# EAGLE design floppyconv (EAGLE 6.5.0)
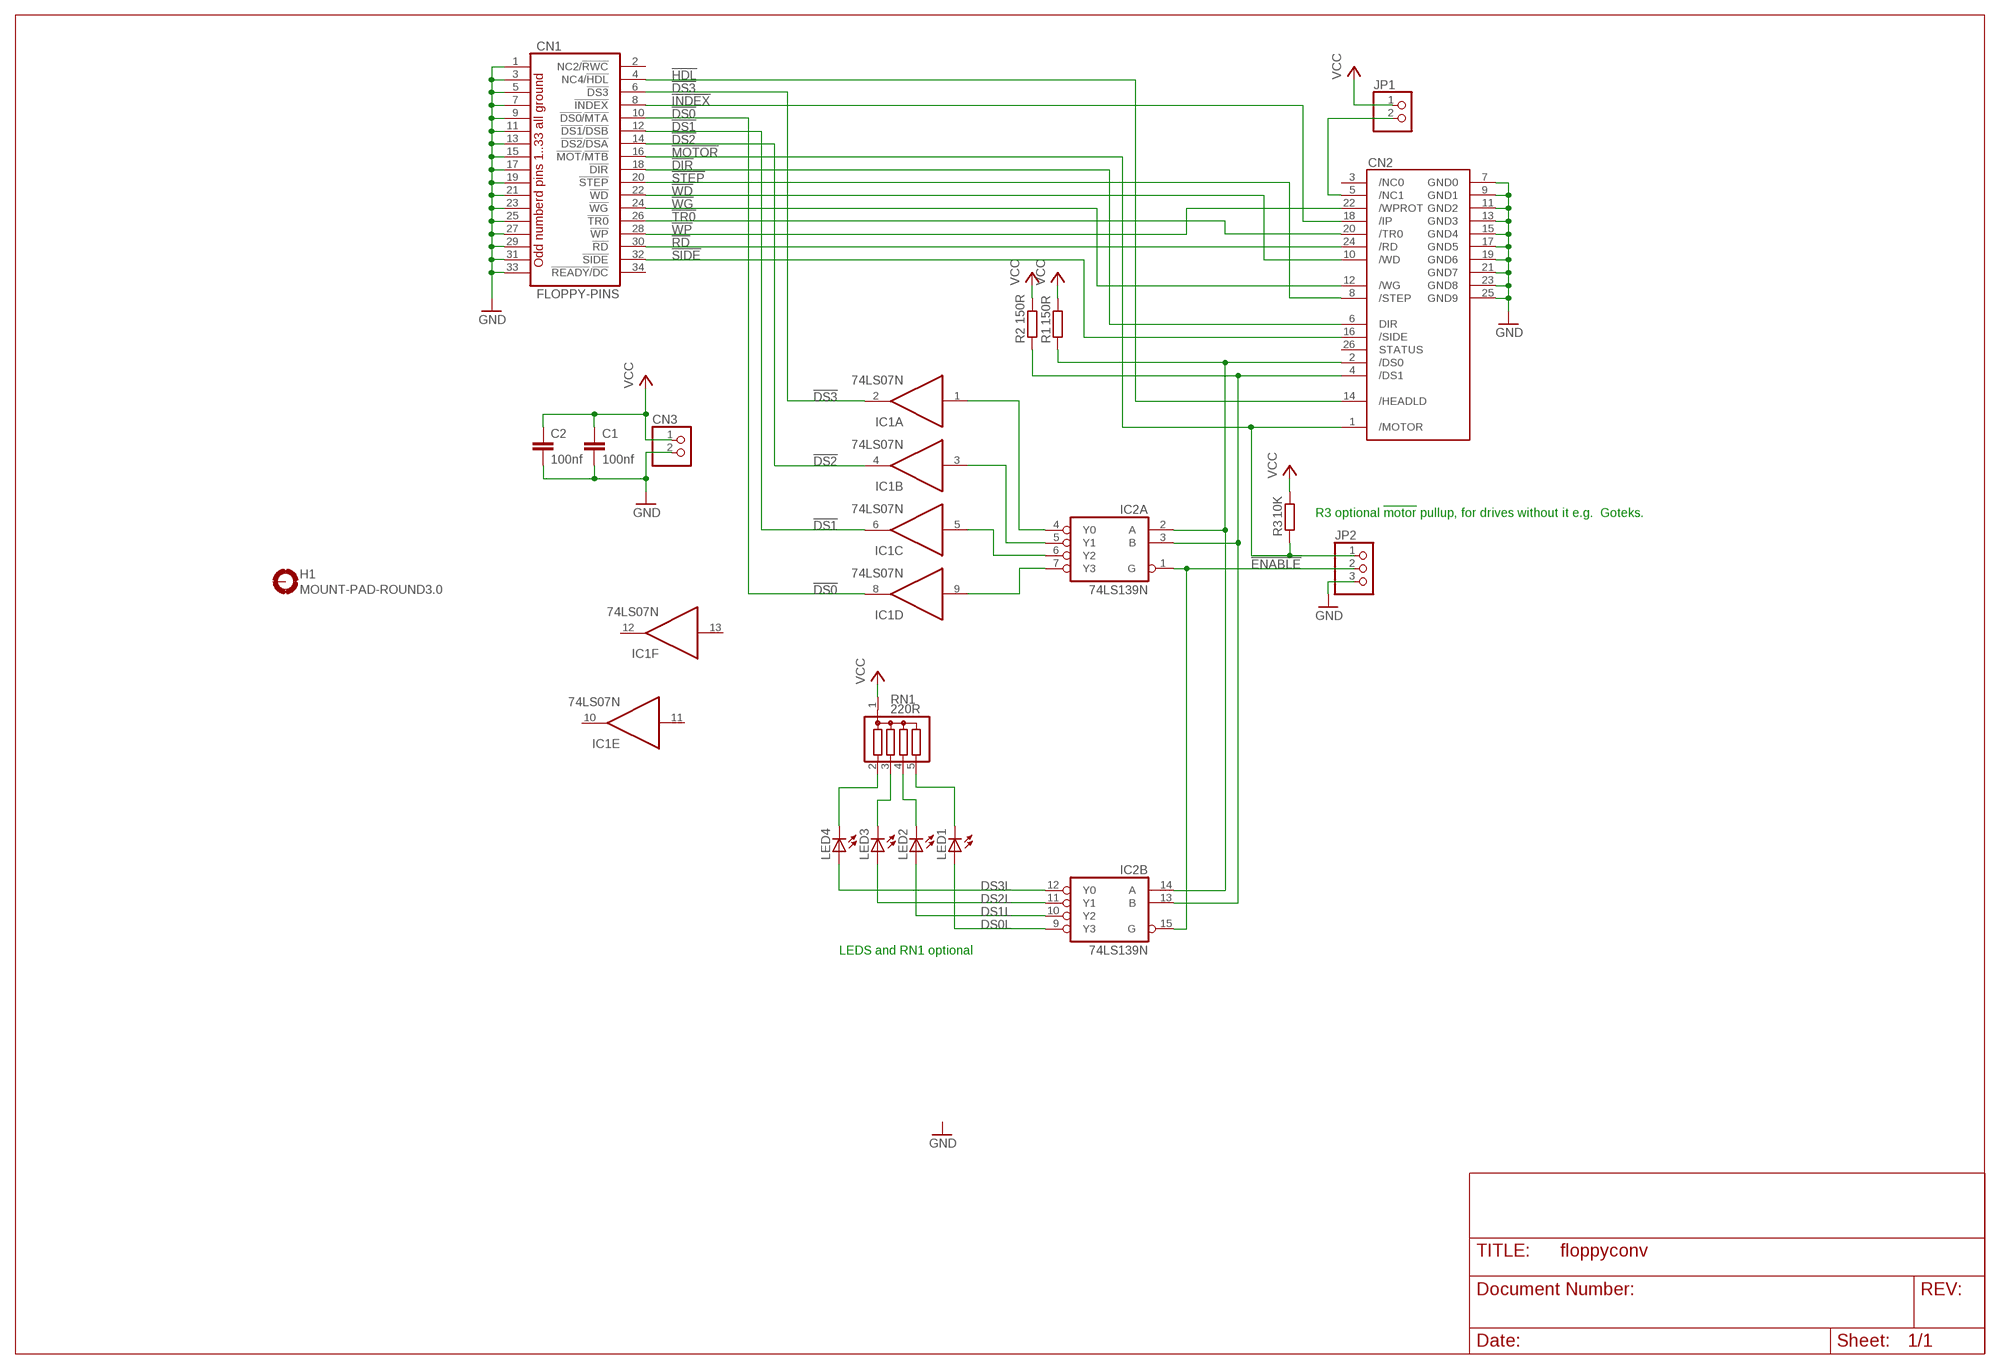
[diagram p0: schematic, sheet 1]

## Parts
C1  100nf  C-EU025-025X050  [C025-025X050]
C2  100nf  C-EU025-025X050  [C025-025X050]
CN1  FLOPPY-PINS  [FLOPPY-PINS]
CN2  DRAGON-BETA-FLOPPY  [2X13]
CN3  PINHD-1X2  [1X02]
H1  MOUNT-PAD-ROUND3.0  [3,0-PAD]
IC1  74LS07N  [DIL14]
IC2  74LS139N  [DIL16]
JP1  PINHD-1X2  [1X02]
JP2  PINHD-1X3  [1X03]
LED1  LED3MM  [LED3MM]
LED2  LED3MM  [LED3MM]
LED3  LED3MM  [LED3MM]
LED4  LED3MM  [LED3MM]
R1  150R  R-EU_0207/10  [0207/10]
R2  150R  R-EU_0207/10  [0207/10]
R3  10K  R-EU_0207/10  [0207/10]
RN1  220R  G04R-R  [SIL5R]

## Nets
!BDS0: CN2.2(/DS0) IC2.2(A:A) IC2.14(B:A) R1.1
!BDS1: CN2.4(/DS1) IC2.3(A:B) IC2.13(B:B) R2.1
!DIR: CN1.18(!DIR) CN2.6(DIR)
!DS0: CN1.10(!DS0!/!MTA) IC1.8(D:O)
!DS1: CN1.12(!DS1!/!DSB) IC1.6(C:O)
!DS2: CN1.14(!DS2!/!DSA) IC1.4(B:O)
!DS3: CN1.6(!DS3) IC1.2(A:O)
!ENABLE: IC2.1(A:G) IC2.15(B:G) JP2.2
!HDL: CN1.4(NC4/!HDL) CN2.14(/HEADLD)
!INDEX: CN1.8(!INDEX) CN2.18(/IP)
!MOTOR: CN1.16(!MOT!/!MTB) CN2.1(/MOTOR) JP2.1 R3.1
!RD: CN1.30(!RD) CN2.24(/RD)
!SIDE: CN1.32(!SIDE) CN2.16(/SIDE)
!STEP: CN1.20(!STEP) CN2.8(/STEP)
!TR0: CN1.26(!TR0) CN2.20(/TR0)
!WD: CN1.22(!WD) CN2.10(/WD)
!WG: CN1.24(!WG) CN2.12(/WG)
!WP: CN1.28(!WP) CN2.22(/WPROT)
DS0L: IC2.9(B:Y3) LED1.A
DS1L: IC2.10(B:Y2) LED2.A
DS2L: IC2.11(B:Y1) LED3.A
DS3L: IC2.12(B:Y0) LED4.A
GND: C1.2 C2.2 CN1.1(GND) CN1.3(GND) CN1.5(GND) CN1.7(GND) CN1.9(GND) CN1.11(GND) CN1.13(GND) CN1.15(GND) CN1.17(GND) CN1.19(GND) CN1.21(GND) CN1.23(GND) CN1.25(GND) CN1.27(GND) CN1.29(GND) CN1.31(GND) CN1.33(GND) CN2.7(GND0) CN2.9(GND1) CN2.11(GND2) CN2.13(GND3) CN2.15(GND4) CN2.17(GND5) CN2.19(GND6) CN2.21(GND7) CN2.23(GND8) CN2.25(GND9) CN3.2 JP2.3
N$1: IC1.1(A:I) IC2.4(A:Y0)
N$2: IC1.3(B:I) IC2.5(A:Y1)
N$3: IC1.5(C:I) IC2.6(A:Y2)
N$4: IC1.9(D:I) IC2.7(A:Y3)
N$9: LED1.K(C) RN1.5
N$10: LED2.K(C) RN1.4
N$11: LED3.K(C) RN1.3
N$12: LED4.K(C) RN1.2
N$13: CN2.5(/NC1) JP1.2
VCC: C1.1 C2.1 CN3.1 JP1.1 R1.2 R2.2 R3.2 RN1.1
Unconnected: CN1.2(NC2/!RWC) CN1.34(!READY!/!DC) CN2.3(/NC0) CN2.26(STATUS) H1.B3,0(MOUNT) IC1.10(E:O) IC1.11(E:I) IC1.12(F:O) IC1.13(F:I)

## Notes on the sheet
- R3 optional !motor! pullup, for drives without it e.g.  Goteks.
- LEDS and RN1 optional

## Power pins joined to a net without a drawn wire
GND: IC1.7(P:GND) IC2.8(P:GND)
VCC: IC1.14(P:VCC) IC2.16(P:VCC)

## Library data of the parts
C1 C2 = rcl:C-EU: CAPACITOR, European symbol
CN1 = Conn-floppy:FLOPPY-PINS: Standard Shugart floppy connector as used on 3.5" drives
CN2 = Conn-floppy:DRAGON-BETA-FLOPPY
CN3 JP1 = pinhead-round:PINHD-1X2: PIN HEADER
H1 = holes:MOUNT-PAD-ROUND: MOUNTING PAD, round
IC1 = 74xx-eu-round:74*07: Hex BUFFER, open collector high-voltage output
IC2 = 74xx-eu-round:74*139: Dual 2-line to 4-line DECODER/DEMULTIPLEXER
JP2 = pinhead-round:PINHD-1X3: PIN HEADER
LED1-LED4 = led:LED: LED OSRAM: - CHIPLED LG R971, LG N971, LY N971, LG Q971, LY Q971, LO R971, LY R971 LH N974, LH R974 LS Q976, LO Q976, LY Q976 LO Q996 - Hyper CHIPLED LW Q18S LB Q993, LB Q99A, LB R99A - SideLED LS A670, LO A670, LY A670, LG A670, LP A670 LB A673, LV A673, LT A673, LW A673 LH A674 LY A675 LS A676, LA A676, LO A676, LY A676, LW A676 LS A679, LY A679, LG A679 - Hyper Micro SIDELED® LS Y876, LA Y876, LO Y876, LY Y876 LT Y87S - SmartLED LW L88C, LW L88S LB L89C, LB L89S, LG L890 LS L89K, LO L89K, LY L89K LS L896, LA L896, LO L896, LY L896 - TOPLED LS T670, LO T670, LY T670, LG T670, LP T670 LSG T670, LSP T670, LSY T670, LOP T670, LYG T670 LG T671, LOG T671, LSG T671 LB T673, LV T673, LT T673, LW T673 LH T674 LS T676, LA T676, LO T676, LY T676, LB T676, LH T676, LSB T676, LW T676 LB T67C, LV T67C, LT T67C, LS T67K, LO T67K, LY T67K, LW E67C LS E67B, LA E67B, LO E67B, LY E67B, LB E67C, LV E67C, LT E67C LW T67C LS T679, LY T679, LG T679 LS T770, LO T770, LY T770, LG T770, LP T770 LB T773, LV T773, LT T773, LW T773 LH T774 LS E675, LA E675, LY E675, LS T675 LS T776, LA T776, LO T776, LY T776, LB T776 LHGB T686 LT T68C, LB T68C - Hyper Mini TOPLED® LB M676 - Mini TOPLED Santana® LG M470 LS M47K, LO M47K, LY M47K Source: http://www.osram.convergy.de LUXEON: - LUMILED® LXK2-PW12-R00, LXK2-PW12-S00, LXK2-PW14-U00, LXK2-PW14-V00 LXK2-PM12-R00, LXK2-PM12-S00, LXK2-PM14-U00 LXK2-PE12-Q00, LXK2-PE12-R00, LXK2-PE12-S00, LXK2-PE14-T00, LXK2-PE14-U00 LXK2-PB12-K00, LXK2-PB12-L00, LXK2-PB12-M00, LXK2-PB14-N00, LXK2-PB14-P00, LXK2-PB14-Q00 LXK2-PR12-L00, LXK2-PR12-M00, LXK2-PR14-Q00, LXK2-PR14-R00 LXK2-PD12-Q00, LXK2-PD12-R00, LXK2-PD12-S00 LXK2-PH12-R00, LXK2-PH12-S00 LXK2-PL12-P00, LXK2-PL12-Q00, LXK2-PL12-R00 Source: www.luxeon.com KINGBRIGHT: KA-3528ASYC Source: www.kingbright.com
R1-R3 = rcl:R-EU_: RESISTOR, European symbol
RN1 = Misc:G04R: SIL RESISTOR

## Board
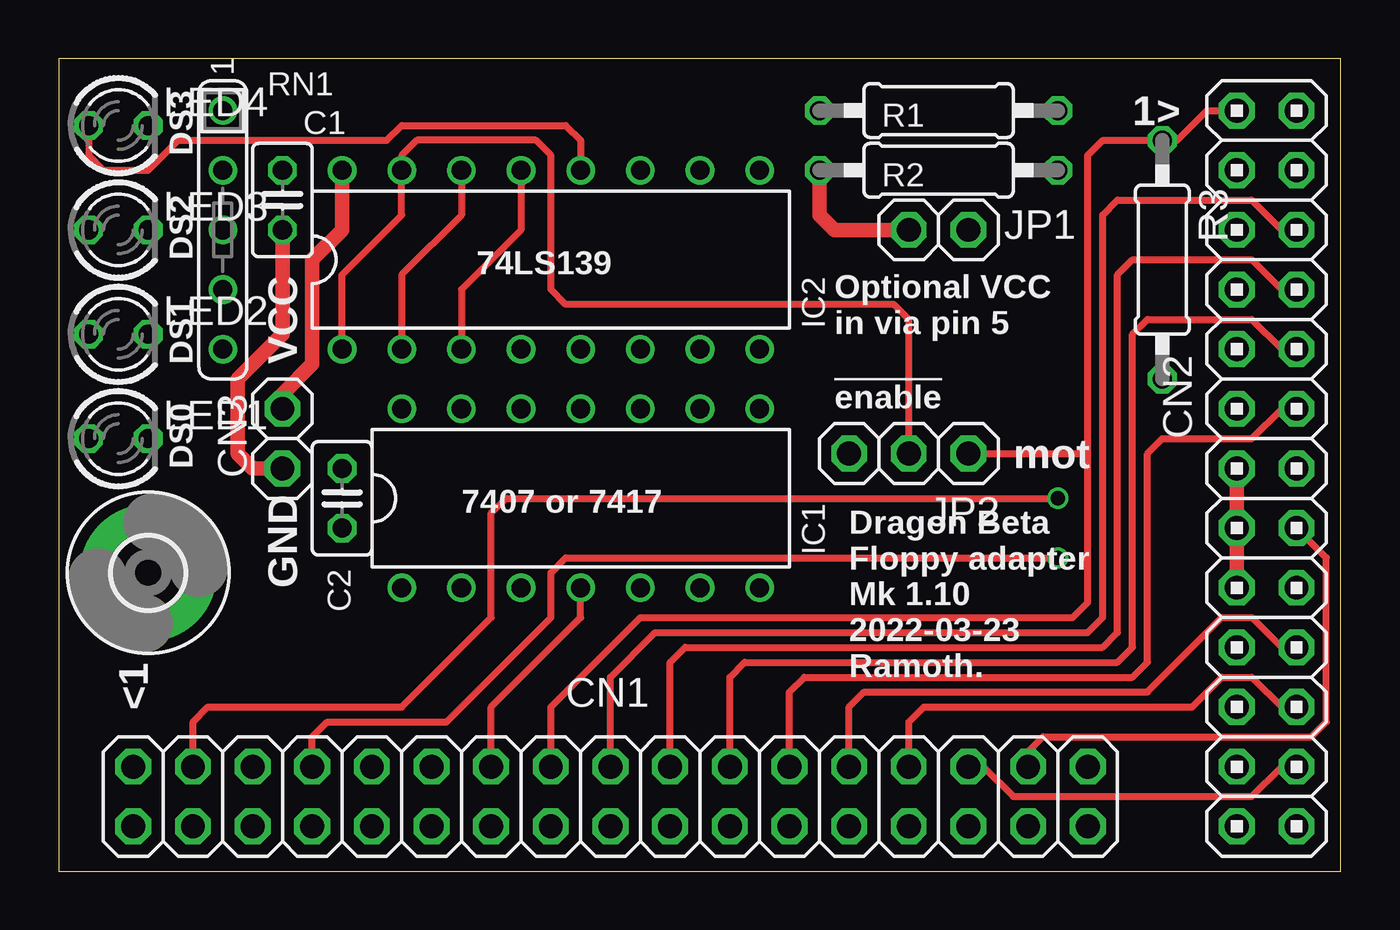
[diagram p1: board, top side]
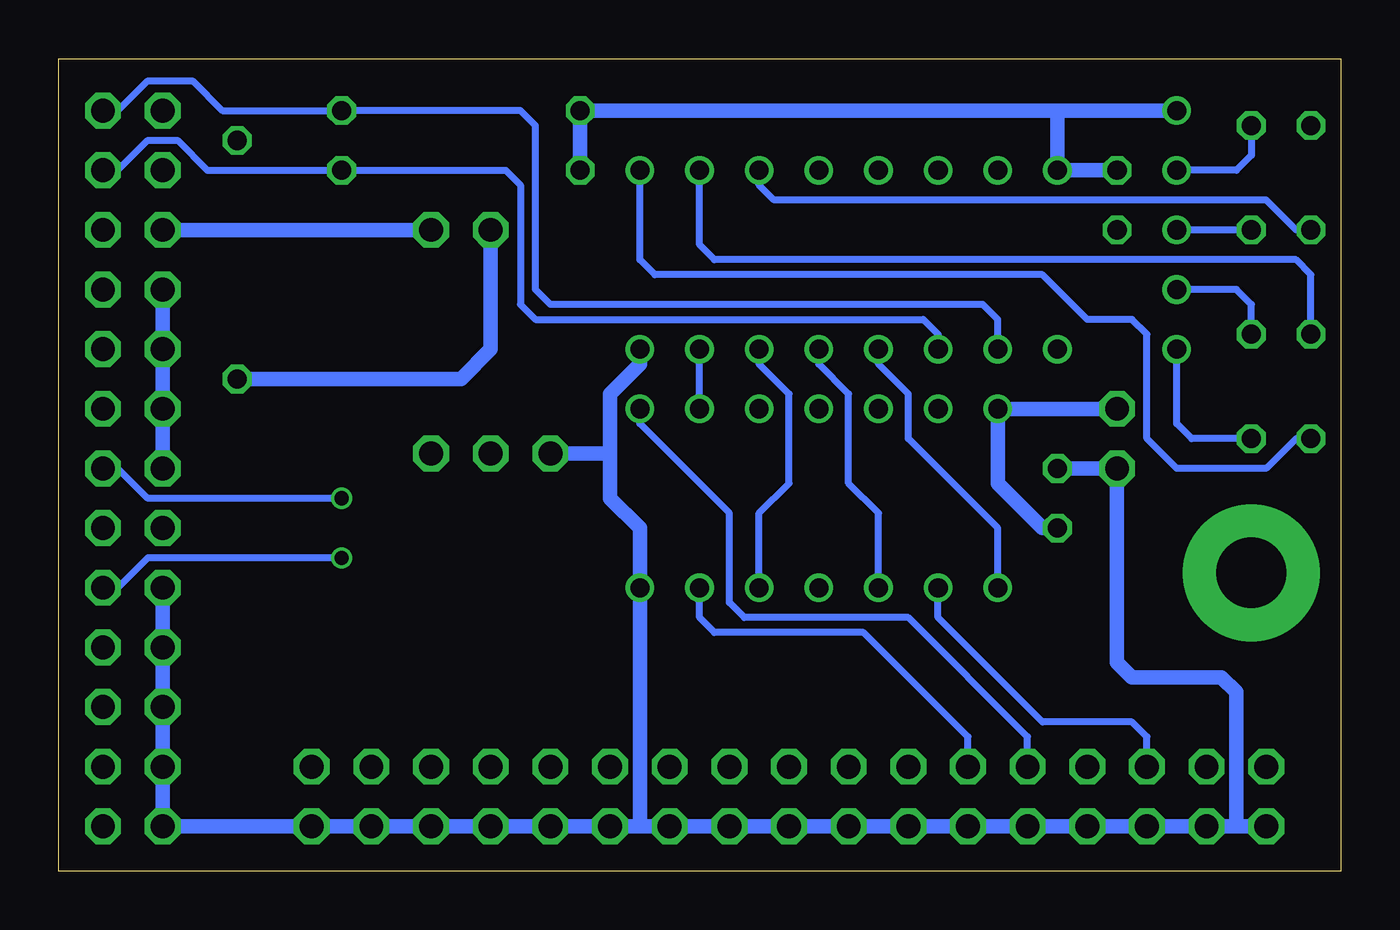
[diagram p2: board, bottom side, seen from below]

Size 54.59 x 34.59 mm. Coordinates in mm from the lower left corner, seen from the top.
Outline: 0,0 54.59,0 54.59,34.59 0,34.59 0,0
Copper layers (1*16): Top 0.035559375mm / dielectric 1.6mm / Bottom 0.035559375mm
Design rules "oshpark-2layer": minimum track width 6mil, minimum drill 10mil, track to track 6mil, track to pad 6mil, pad to pad 6mil, via to via 6mil, smd to smd 6mil, copper to edge 15mil, drill to drill 6mil, minimum pad ring 5mil, minimum via ring 5mil, stop-mask expansion 2.5mil, vias tented up to drill 0mil, thermal gap 10mil

### Footprints (pad centres in the part's own frame; a part is rotated, then mirrored left to right if it is on the bottom)
C025-025X050 = drill 0.813 octagon: 1 -1.27,0; 2 1.27,0
FLOPPY-PINS = drill 1.016 octagon: 1 -20.32,-1.27; 2 -20.32,1.27; 3 -17.78,-1.27; 4 -17.78,1.27; 5 -15.24,-1.27; 6 -15.24,1.27; 7 -12.7,-1.27; 8 -12.7,1.27; 9 -10.16,-1.27; 10 -10.16,1.27; 11 -7.62,-1.27; 12 -7.62,1.27; 13 -5.08,-1.27; 14 -5.08,1.27; 15 -2.54,-1.27; 16 -2.54,1.27; 17 0,-1.27; 18 0,1.27; 19 2.54,-1.27; 20 2.54,1.27; 21 5.08,-1.27; 22 5.08,1.27; 23 7.62,-1.27; 24 7.62,1.27; 25 10.16,-1.27; 26 10.16,1.27; 27 12.7,-1.27; 28 12.7,1.27; 29 15.24,-1.27; 30 15.24,1.27; 31 17.78,-1.27; 32 17.78,1.27; 33 20.32,-1.27; 34 20.32,1.27
2X13 = drill 1.016 octagon: 1 -15.24,-1.27; 2 -15.24,1.27; 3 -12.7,-1.27; 4 -12.7,1.27; 5 -10.16,-1.27; 6 -10.16,1.27; 7 -7.62,-1.27; 8 -7.62,1.27; 9 -5.08,-1.27; 10 -5.08,1.27; 11 -2.54,-1.27; 12 -2.54,1.27; 13 0,-1.27; 14 0,1.27; 15 2.54,-1.27; 16 2.54,1.27; 17 5.08,-1.27; 18 5.08,1.27; 19 7.62,-1.27; 20 7.62,1.27; 21 10.16,-1.27; 22 10.16,1.27; 23 12.7,-1.27; 24 12.7,1.27; 25 15.24,-1.27; 26 15.24,1.27
1X02 = drill 1.016 octagon: 1 -1.27,0; 2 1.27,0
3,0-PAD = drill 3 pad 5.842: B3,0 0,0
DIL14 = drill 0.813: 1 -7.62,-3.81; 2 -5.08,-3.81; 3 -2.54,-3.81; 4 0,-3.81; 5 2.54,-3.81; 6 5.08,-3.81; 7 7.62,-3.81; 8 7.62,3.81; 9 5.08,3.81; 10 2.54,3.81; 11 0,3.81; 12 -2.54,3.81; 13 -5.08,3.81; 14 -7.62,3.81
DIL16 = drill 0.813: 1 -8.89,-3.81; 2 -6.35,-3.81; 3 -3.81,-3.81; 4 -1.27,-3.81; 5 1.27,-3.81; 6 3.81,-3.81; 7 6.35,-3.81; 8 8.89,-3.81; 9 8.89,3.81; 10 6.35,3.81; 11 3.81,3.81; 12 1.27,3.81; 13 -1.27,3.81; 14 -3.81,3.81; 15 -6.35,3.81; 16 -8.89,3.81
1X03 = drill 1.016 octagon: 1 -2.54,0; 2 0,0; 3 2.54,0
LED3MM = drill 0.813 octagon: A -1.27,0; K 1.27,0
0207/10 = drill 0.813 octagon: 1 -5.08,0; 2 5.08,0
SIL5R = drill 0.813: 1 -5.08,0; 2 -2.54,0; 3 0,0; 4 2.54,0; 5 5.08,0

### Placement (x,y rotation side)
C1  9.53,28.57 270 top
C2  12.06,15.88 90 top
CN1  23.5,3.17 0 top
CN2  51.44,17.14 270 top
CN3  9.53,18.41 270 top
H1  3.81,12.7 0 top
IC1  22.23,15.88 0 top
IC2  20.95,26.04 0 top
JP1  37.47,27.3 0 top
JP2  36.2,17.78 180 top
LED1  2.54,18.41 0 top
LED2  2.54,22.86 0 top
LED3  2.54,27.3 0 top
LED4  2.54,31.75 0 top
R1  37.47,32.38 180 top
R2  37.47,29.84 180 top
R3  46.99,26.04 270 top
RN1  6.99,27.3 270 top

### Tracks (layer width: path | path; a pad name or v marks a point on that pad's centre or on a via)
!BDS0
  Top 0.305: IC2.14 17.14,27.94 14.61,25.4 IC2.2
  Bottom 0.305: CN2.2 52.07,32.38 50.8,33.66 48.9,33.66 47.62,32.38 R1.1 34.92,32.38 34.29,31.75 34.29,24.77 33.66,24.13 15.24,24.13 14.61,23.5 IC2.2
!BDS1
  Top 0.305: IC2.13 19.68,27.3 17.14,24.77 IC2.3
  Bottom 0.305: CN2.4 52.07,29.84 50.8,31.11 49.53,31.11 48.26,29.84 R2.1 35.56,29.84 34.92,29.21 34.92,24.13 34.29,23.5 17.78,23.5 17.14,22.86 IC2.3
!DIR
  Top 0.305: CN1.18 23.5,8.26 25.4,10.16 43.81,10.16 44.45,10.79 44.45,27.94 45.09,28.57 50.8,28.57 52.07,27.3 CN2.6
!DS0
  Bottom 0.305: CN1.10 13.34,5.71 18.41,10.79 25.4,10.79 26.04,11.43 26.04,15.24 29.84,19.05 IC1.8
!DS1
  Bottom 0.305: CN1.12 15.88,5.71 20.32,10.16 26.67,10.16 27.3,10.79 IC1.6
!DS2
  Top 0.305: CN1.14 18.41,6.99 22.23,10.79 IC1.4
!DS3
  Bottom 0.305: CN1.6 8.26,5.71 8.89,6.35 12.7,6.35 17.14,10.79 IC1.2
!ENABLE
  Top 0.305: IC2.1 12.06,25.4 14.61,27.94 IC2.15 14.61,30.48 15.24,31.11 20.32,31.11 20.95,30.48 20.95,24.77 21.59,24.13 35.56,24.13 36.2,23.5 JP2.2
!HDL  (via drill 0.6)
  Top 0.305: CN1.4 5.71,6.35 6.35,6.99 14.61,6.99 18.41,10.79 18.41,15.24 19.05,15.88 v42.55,15.88
  Bottom 0.305: v42.55,15.88 50.8,15.88 52.07,17.14 CN2.14
!INDEX  (via drill 0.6)
  Top 0.305: CN1.8 10.79,5.71 11.43,6.35 16.51,6.35 20.95,10.79 20.95,12.7 21.59,13.34 v42.55,13.34
  Bottom 0.305: v42.55,13.34 50.8,13.34 52.07,12.06 CN2.18
!MOTOR
  Top 0.305: CN1.16 20.95,6.99 24.77,10.79 43.18,10.79 43.81,11.43 43.81,17.78 | 43.81,17.78 43.81,30.48 44.45,31.11 R3.1 47.62,31.11 48.9,32.38 CN2.1 | JP2.1 43.81,17.78
!RD
  Top 0.305: CN1.30 39.37,4.45 40.64,3.17 50.8,3.17 52.07,4.45 CN2.24
!SIDE
  Top 0.305: CN1.32 41.27,5.08 41.91,5.71 53.34,5.71 53.98,6.35 53.98,13.34 CN2.16
!STEP
  Top 0.305: CN2.8 52.07,24.77 50.8,26.04 45.72,26.04 45.09,25.4 45.09,10.16 44.45,9.53 26.67,9.53 26.04,8.89 CN1.20
!TR0
  Top 0.305: CN1.26 33.66,6.99 34.29,7.62 46.35,7.62 49.53,10.79 50.8,10.79 52.07,9.53 CN2.20
!WD
  Top 0.305: CN2.10 52.07,22.23 50.8,23.5 46.35,23.5 45.72,22.86 45.72,9.53 45.09,8.89 29.21,8.89 28.57,8.26 CN1.22
!WG
  Top 0.305: CN1.24 31.11,7.62 31.75,8.26 45.72,8.26 46.35,8.89 46.35,17.78 46.99,18.41 50.8,18.41 52.07,19.68 CN2.12
!WP
  Top 0.305: CN1.28 36.2,6.35 36.83,6.99 48.26,6.99 49.53,8.26 50.8,8.26 52.07,6.99 CN2.22
DS0L
  Bottom 0.305: LED1.A 1.91,18.41 3.17,17.14 6.99,17.14 8.26,18.41 8.26,22.86 8.89,23.5 10.79,23.5 12.7,25.4 29.21,25.4 29.84,26.04 IC2.9
DS1L
  Bottom 0.305: LED2.A 1.27,25.4 1.91,26.04 26.67,26.04 27.3,26.67 IC2.10
DS2L
  Bottom 0.305: LED3.A 1.91,27.3 3.17,28.57 24.13,28.57 24.77,29.21 IC2.11
DS3L
  Top 0.305: LED4.A 1.27,30.48 1.91,29.84 3.81,29.84 5.08,31.11 13.97,31.11 14.61,31.75 21.59,31.75 22.23,31.11 IC2.12
GND
  Top 0.61: CN2.13 CN2.15 CN2.17 | C1.2 9.53,22.86 7.62,20.95 7.62,17.78 8.26,17.14 CN3.2
  Bottom 0.61: 4.45,1.91 CN1.3 CN1.5 CN1.7 CN1.9 CN1.11 CN1.13 CN1.15 CN1.17 CN1.19 CN1.21 29.84,1.91 | 29.84,1.91 CN1.23 CN1.25 CN1.27 CN1.29 CN1.31 CN1.33 CN2.25 CN2.23 CN2.21 CN2.19 CN2.17 | CN2.7 CN2.9 CN2.11 CN2.13 | IC2.8 29.84,21.59 31.11,20.32 31.11,17.78 | 31.11,17.78 31.11,15.88 29.84,14.61 IC1.7 29.84,1.91 | 4.45,1.91 4.45,7.62 5.08,8.26 8.89,8.26 9.53,8.89 CN3.2 C2.2 | CN1.1 4.45,1.91 | JP2.3 31.11,17.78
N$1
  Bottom 0.305: IC1.1 14.61,14.61 18.41,18.41 18.41,20.32 19.68,21.59 IC2.4
N$2
  Bottom 0.305: IC1.3 19.68,15.24 20.95,16.51 20.95,20.32 22.23,21.59 IC2.5
N$3
  Bottom 0.305: IC1.5 24.77,15.24 23.5,16.51 23.5,20.32 24.77,21.59 IC2.6
N$4
  Bottom 0.305: IC1.9 IC2.7
N$9
  Bottom 0.305: LED1.K 6.35,18.41 6.99,19.05 RN1.5
N$10
  Bottom 0.305: LED2.K 3.81,24.13 4.45,24.77 RN1.4
N$11
  Bottom 0.305: LED3.K RN1.3
N$12
  Bottom 0.305: LED4.K 3.81,30.48 4.45,29.84 RN1.2
N$13
  Bottom 0.61: JP1.2 CN2.5
VCC
  Top 0.61: IC2.16 12.06,27.3 10.79,26.04 10.79,21.59 9.53,20.32 CN3.1 | R2.2 32.38,27.94 33.02,27.3 JP1.1
  Bottom 0.61: 12.06,32.38 R1.2 R2.2 | 12.06,32.38 IC2.16 C1.1 | 12.06,32.38 RN1.1 | CN3.1 IC1.14 14.61,16.51 12.7,14.61 C2.1 | R3.2 37.47,20.95 36.2,22.23 JP1.1

### Text on the board
tPlace: 1> | DS3 | DS2 | 74LS139 | Optional VCC / in via pin 5 | DS1 | VCC | !enable | DS0 | mot | 7407 or 7417 | GND | <1 | Dragon Beta / Floppy adapter / Mk 1.10 / 2022-03-23 / Ramoth.